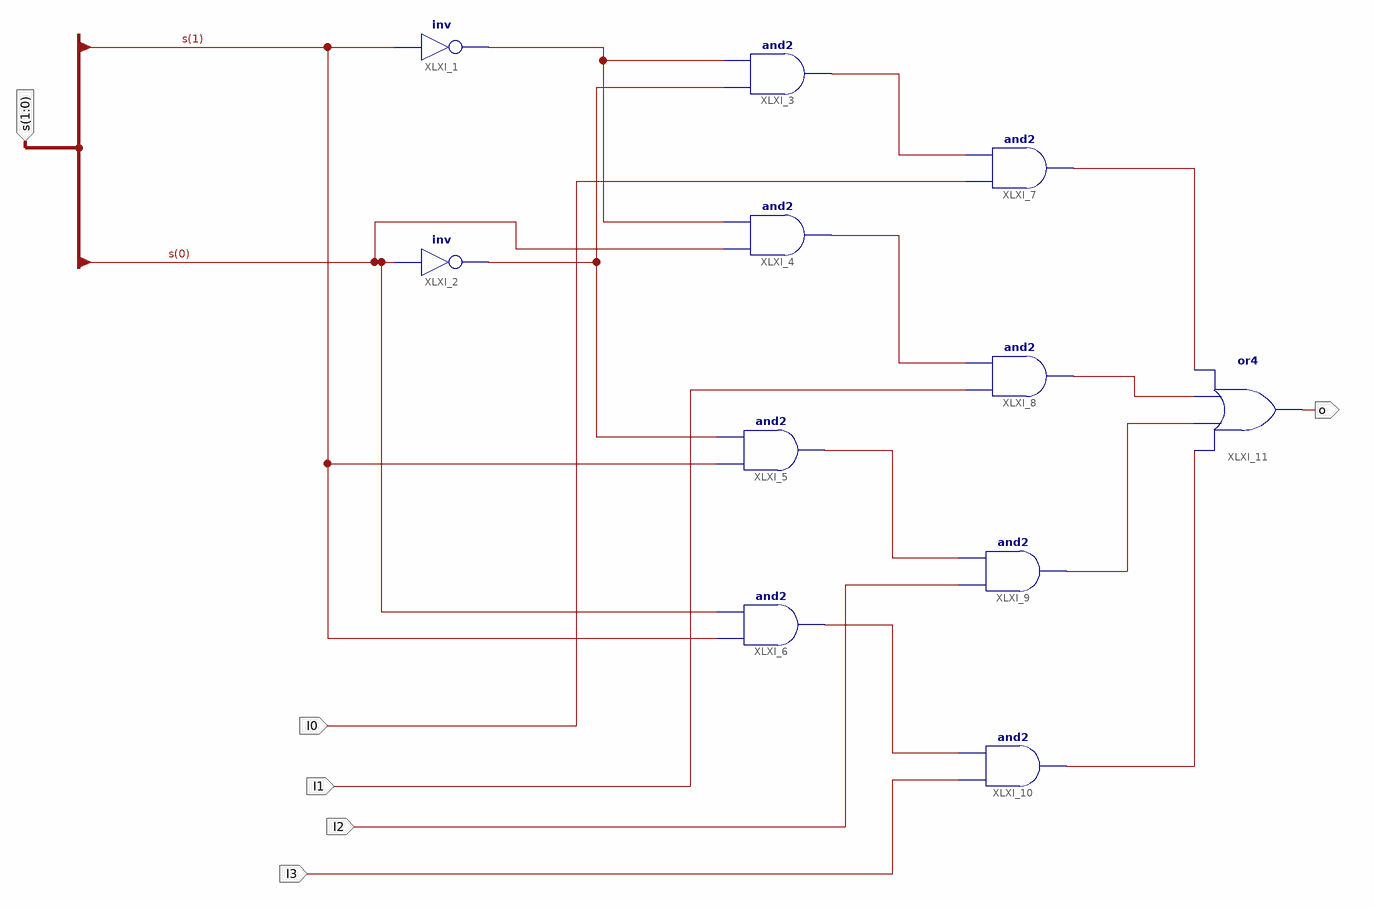
[diagram p0: schematic sheet 1]
// Xilinx ISE schematic Mux4to1_sch.sch (kintex7) as structural Verilog: 11 symbols, 6 ports
module Mux4to1_sch (
  input  I0,
  input  I1,
  input  I2,
  input  I3,
  input  [1:0] s,
  output o
);

  wire XLXN_4, XLXN_6, XLXN_11, XLXN_12, XLXN_13, XLXN_14, XLXN_15, XLXN_17, XLXN_18, XLXN_19;

  not XLXI_1 (XLXN_4, s[1]);
  not XLXI_2 (XLXN_6, s[0]);
  and XLXI_3 (XLXN_11, XLXN_6, XLXN_4);
  and XLXI_4 (XLXN_12, s[0], XLXN_4);
  and XLXI_5 (XLXN_13, s[1], XLXN_6);
  and XLXI_6 (XLXN_14, s[1], s[0]);
  and XLXI_7 (XLXN_17, I0, XLXN_11);
  and XLXI_8 (XLXN_15, I1, XLXN_12);
  and XLXI_9 (XLXN_18, I2, XLXN_13);
  and XLXI_10 (XLXN_19, I3, XLXN_14);
  or XLXI_11 (o, XLXN_19, XLXN_18, XLXN_15, XLXN_17);
endmodule
